# EAGLE design Cube_8x8x8_LED_Base (EAGLE 9.6.2)
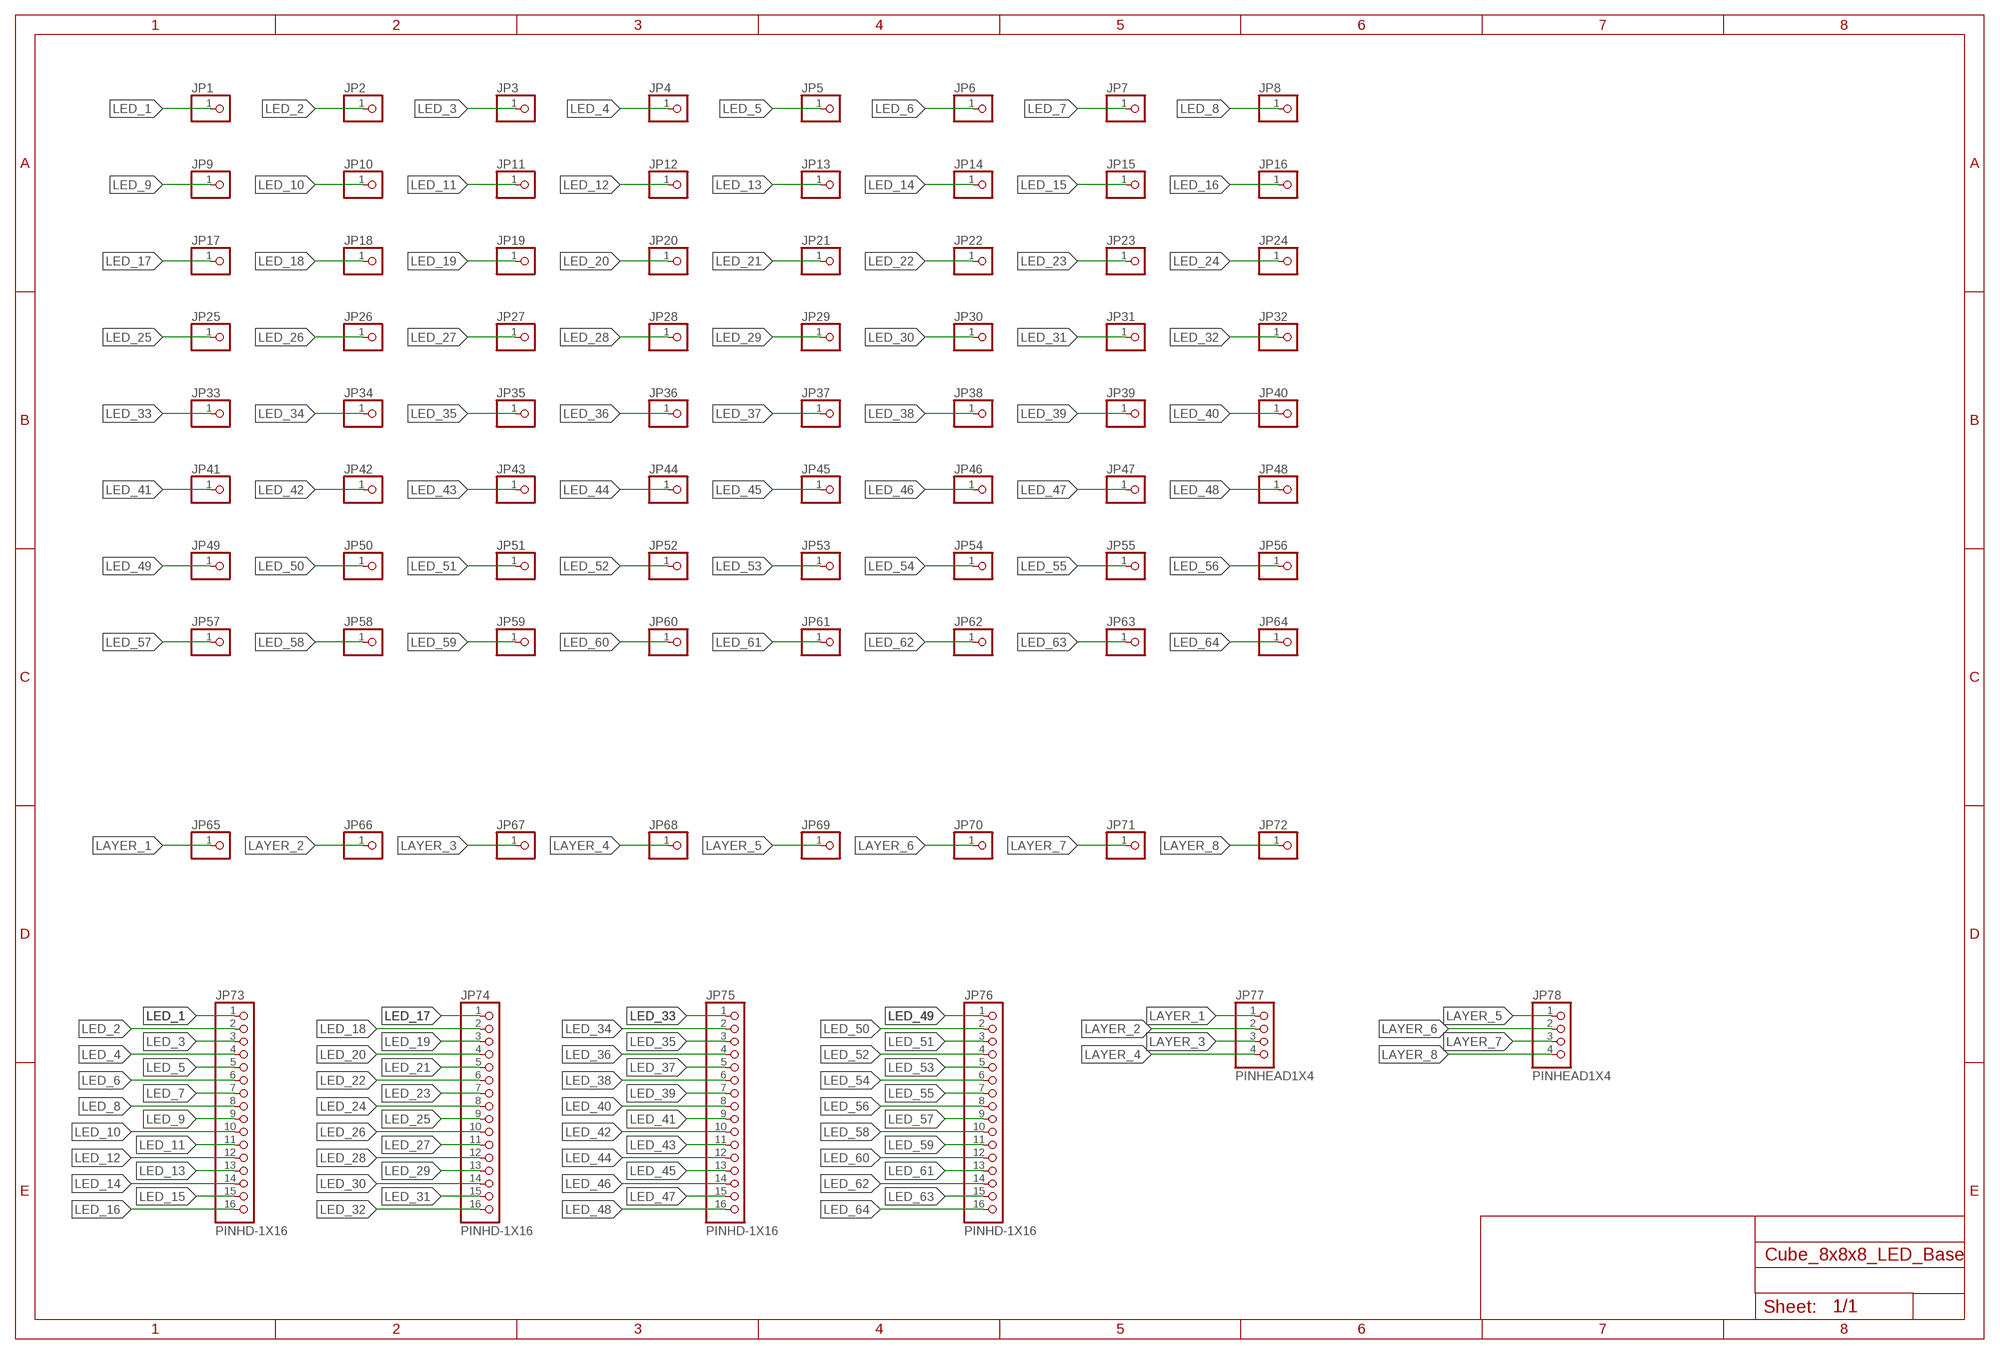
[diagram p0: schematic, sheet 1]

## Parts
JP1  PINHD-1X1  [1X01]
JP2  PINHD-1X1  [1X01]
JP3  PINHD-1X1  [1X01]
JP4  PINHD-1X1  [1X01]
JP5  PINHD-1X1  [1X01]
JP6  PINHD-1X1  [1X01]
JP7  PINHD-1X1  [1X01]
JP8  PINHD-1X1  [1X01]
JP9  PINHD-1X1  [1X01]
JP10  PINHD-1X1  [1X01]
JP11  PINHD-1X1  [1X01]
JP12  PINHD-1X1  [1X01]
JP13  PINHD-1X1  [1X01]
JP14  PINHD-1X1  [1X01]
JP15  PINHD-1X1  [1X01]
JP16  PINHD-1X1  [1X01]
JP17  PINHD-1X1  [1X01]
JP18  PINHD-1X1  [1X01]
JP19  PINHD-1X1  [1X01]
JP20  PINHD-1X1  [1X01]
JP21  PINHD-1X1  [1X01]
JP22  PINHD-1X1  [1X01]
JP23  PINHD-1X1  [1X01]
JP24  PINHD-1X1  [1X01]
JP25  PINHD-1X1  [1X01]
JP26  PINHD-1X1  [1X01]
JP27  PINHD-1X1  [1X01]
JP28  PINHD-1X1  [1X01]
JP29  PINHD-1X1  [1X01]
JP30  PINHD-1X1  [1X01]
JP31  PINHD-1X1  [1X01]
JP32  PINHD-1X1  [1X01]
JP33  PINHD-1X1  [1X01]
JP34  PINHD-1X1  [1X01]
JP35  PINHD-1X1  [1X01]
JP36  PINHD-1X1  [1X01]
JP37  PINHD-1X1  [1X01]
JP38  PINHD-1X1  [1X01]
JP39  PINHD-1X1  [1X01]
JP40  PINHD-1X1  [1X01]
JP41  PINHD-1X1  [1X01]
JP42  PINHD-1X1  [1X01]
JP43  PINHD-1X1  [1X01]
JP44  PINHD-1X1  [1X01]
JP45  PINHD-1X1  [1X01]
JP46  PINHD-1X1  [1X01]
JP47  PINHD-1X1  [1X01]
JP48  PINHD-1X1  [1X01]
JP49  PINHD-1X1  [1X01]
JP50  PINHD-1X1  [1X01]
JP51  PINHD-1X1  [1X01]
JP52  PINHD-1X1  [1X01]
JP53  PINHD-1X1  [1X01]
JP54  PINHD-1X1  [1X01]
JP55  PINHD-1X1  [1X01]
JP56  PINHD-1X1  [1X01]
JP57  PINHD-1X1  [1X01]
JP58  PINHD-1X1  [1X01]
JP59  PINHD-1X1  [1X01]
JP60  PINHD-1X1  [1X01]
JP61  PINHD-1X1  [1X01]
JP62  PINHD-1X1  [1X01]
JP63  PINHD-1X1  [1X01]
JP64  PINHD-1X1  [1X01]
JP65  PINHD-1X1  [1X01]
JP66  PINHD-1X1  [1X01]
JP67  PINHD-1X1  [1X01]
JP68  PINHD-1X1  [1X01]
JP69  PINHD-1X1  [1X01]
JP70  PINHD-1X1  [1X01]
JP71  PINHD-1X1  [1X01]
JP72  PINHD-1X1  [1X01]
JP73  PINHD-1X16  [2X16]
JP74  PINHD-1X16  [2X16]
JP75  PINHD-1X16  [2X16]
JP76  PINHD-1X16  [2X16]
JP77  PINHEAD1X4  [2X04]
JP78  PINHEAD1X4  [2X04]

## Nets
LAYER_1: JP65.1 JP77.1
LAYER_2: JP66.1 JP77.2
LAYER_3: JP67.1 JP77.3
LAYER_4: JP68.1 JP77.4
LAYER_5: JP69.1 JP78.1
LAYER_6: JP70.1 JP78.2
LAYER_7: JP71.1 JP78.3
LAYER_8: JP72.1 JP78.4
LED_1: JP1.1 JP73.1
LED_2: JP2.1 JP73.2
LED_3: JP3.1 JP73.3
LED_4: JP4.1 JP73.4
LED_5: JP5.1 JP73.5
LED_6: JP6.1 JP73.6
LED_7: JP7.1 JP73.7
LED_8: JP8.1 JP73.8
LED_9: JP9.1 JP73.9
LED_10: JP10.1 JP73.10
LED_11: JP11.1 JP73.11
LED_12: JP12.1 JP73.12
LED_13: JP13.1 JP73.13
LED_14: JP14.1 JP73.14
LED_15: JP15.1 JP73.15
LED_16: JP16.1 JP73.16
LED_17: JP17.1 JP74.1
LED_18: JP18.1 JP74.2
LED_19: JP19.1 JP74.3
LED_20: JP20.1 JP74.4
LED_21: JP21.1 JP74.5
LED_22: JP22.1 JP74.6
LED_23: JP23.1 JP74.7
LED_24: JP24.1 JP74.8
LED_25: JP25.1 JP74.9
LED_26: JP26.1 JP74.10
LED_27: JP27.1 JP74.11
LED_28: JP28.1 JP74.12
LED_29: JP29.1 JP74.13
LED_30: JP30.1 JP74.14
LED_31: JP31.1 JP74.15
LED_32: JP32.1 JP74.16
LED_33: JP33.1 JP75.1
LED_34: JP34.1 JP75.2
LED_35: JP35.1 JP75.3
LED_36: JP36.1 JP75.4
LED_37: JP37.1 JP75.5
LED_38: JP38.1 JP75.6
LED_39: JP39.1 JP75.7
LED_40: JP40.1 JP75.8
LED_41: JP41.1 JP75.9
LED_42: JP42.1 JP75.10
LED_43: JP43.1 JP75.11
LED_44: JP44.1 JP75.12
LED_45: JP45.1 JP75.13
LED_46: JP46.1 JP75.14
LED_47: JP47.1 JP75.15
LED_48: JP48.1 JP75.16
LED_49: JP49.1 JP76.1
LED_50: JP50.1 JP76.2
LED_51: JP51.1 JP76.3
LED_52: JP52.1 JP76.4
LED_53: JP53.1 JP76.5
LED_54: JP54.1 JP76.6
LED_55: JP55.1 JP76.7
LED_56: JP56.1 JP76.8
LED_57: JP57.1 JP76.9
LED_58: JP58.1 JP76.10
LED_59: JP59.1 JP76.11
LED_60: JP60.1 JP76.12
LED_61: JP61.1 JP76.13
LED_62: JP62.1 JP76.14
LED_63: JP63.1 JP76.15
LED_64: JP64.1 JP76.16

## Library data of the parts
JP1-JP72 = pinhead:PINHD-1X1: PIN HEADER
JP73-JP76 = pinhead1x16:PINHD-1X16
JP77 JP78 = pinhead1x4:PINHEAD1X4

## Board
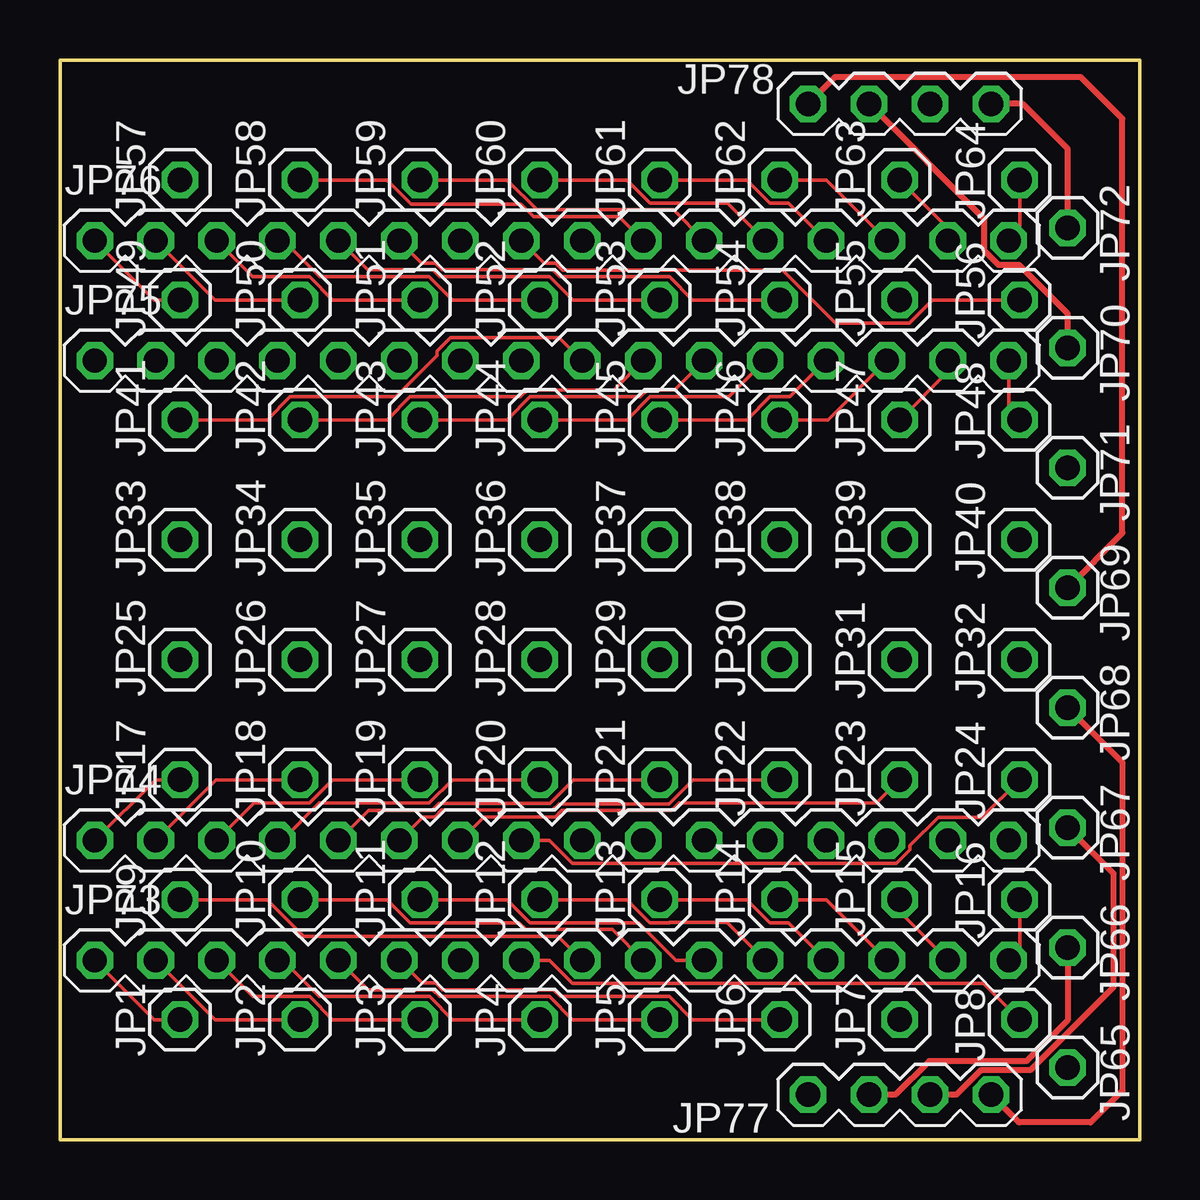
[diagram p1: board, top side]
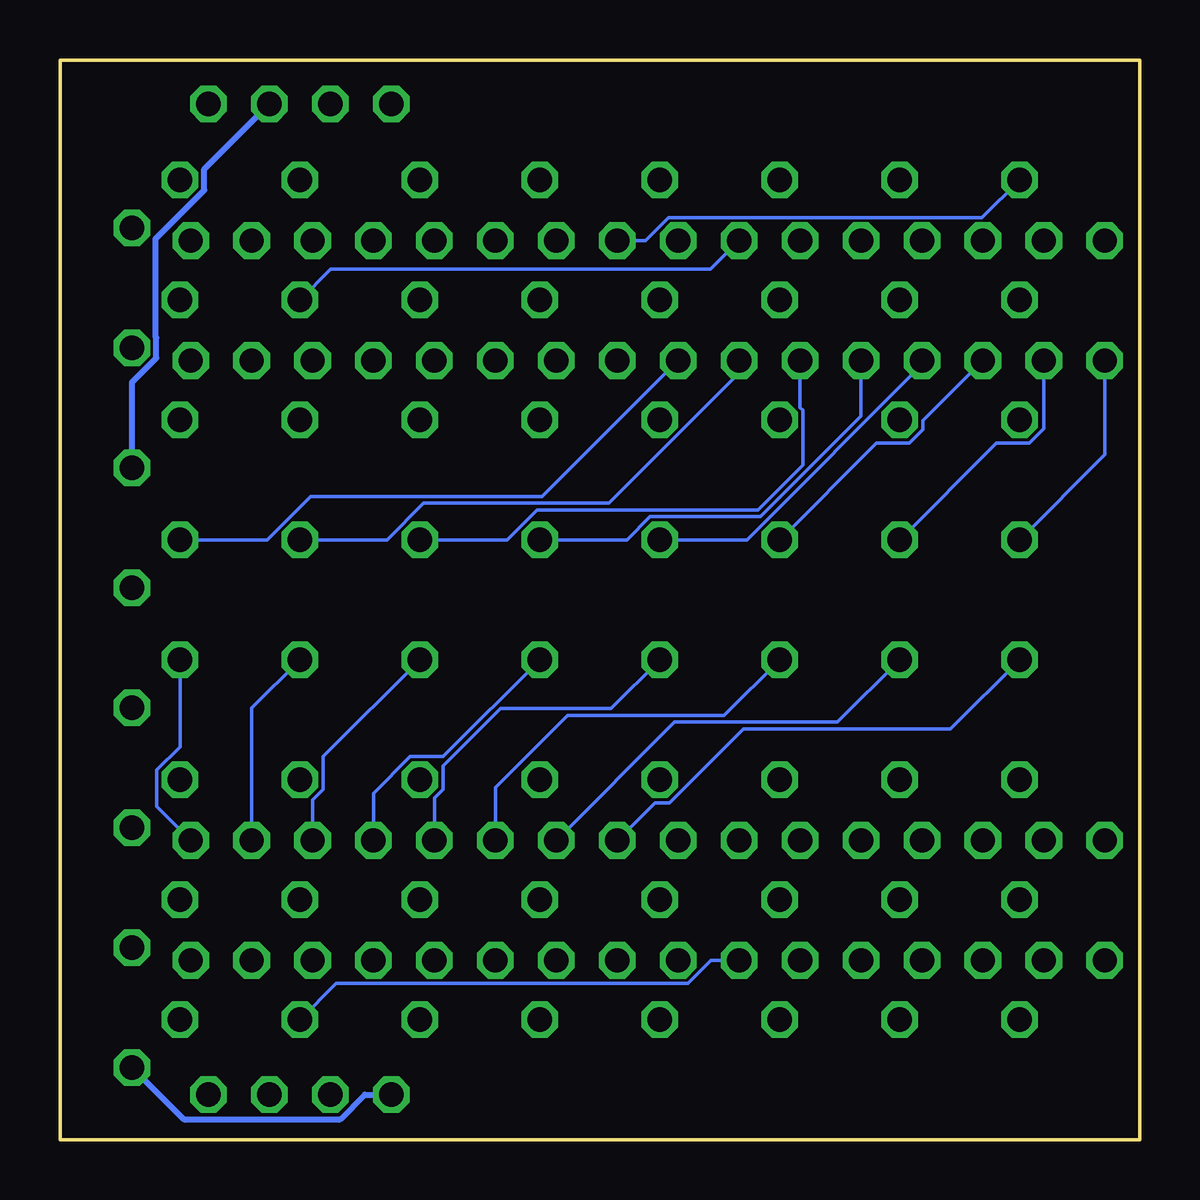
[diagram p2: board, bottom side, seen from below]

Size 45 x 45 mm. Coordinates in mm from the lower left corner, seen from the top.
Outline: 0,0 0,45 45,45 45,0 0,0
Copper layers (1*16): Top 0.035mm / dielectric 1.5mm / Bottom 0.035mm
Design rules "reglejlcpcb": minimum track width 5mil, minimum drill 0.35mm, track to track 5mil, track to pad 5mil, pad to pad 5mil, via to via 5mil, smd to smd 5mil, copper to edge 20mil, drill to drill 20mil, minimum pad ring 10mil, minimum via ring 8mil, stop-mask expansion 4mil, vias tented up to drill 0mil, thermal gap 10mil

### Footprints (pad centres in the part's own frame; a part is rotated, then mirrored left to right if it is on the bottom)
1X01 = drill 1.016 octagon: 1 0,0
2X16 = drill 1.016 octagon: 1 -19.05,1.27; 2 -16.51,1.27; 3 -13.97,1.27; 4 -11.43,1.27; 5 -8.89,1.27; 6 -6.35,1.27; 7 -3.81,1.27; 8 -1.27,1.27; 9 1.27,1.27; 10 3.81,1.27; 11 6.35,1.27; 12 8.89,1.27; 13 11.43,1.27; 14 13.97,1.27; 15 16.51,1.27; 16 19.05,1.27
2X04 = drill 1.016 octagon: 1 -3.81,1.27; 2 -1.27,1.27; 3 1.27,1.27; 4 3.81,1.27

### Placement (x,y rotation side)
JP1  5,5 0 top
JP2  10,5 0 top
JP3  15,5 0 top
JP4  20,5 0 top
JP5  25,5 0 top
JP6  30,5 0 top
JP7  35,5 0 top
JP8  40,5 0 top
JP9  5,10 0 top
JP10  10,10 0 top
JP11  15,10 0 top
JP12  20,10 0 top
JP13  25,10 0 top
JP14  30,10 0 top
JP15  35,10 0 top
JP16  40,10 0 top
JP17  5,15 0 top
JP18  10,15 0 top
JP19  15,15 0 top
JP20  20,15 0 top
JP21  25,15 0 top
JP22  30,15 0 top
JP23  35,15 0 top
JP24  40,15 0 top
JP25  5,20 0 top
JP26  10,20 0 top
JP27  15,20 0 top
JP28  20,20 0 top
JP29  25,20 0 top
JP30  30,20 0 top
JP31  35,20 0 top
JP32  40,20 0 top
JP33  5,25 0 top
JP34  10,25 0 top
JP35  15,25 0 top
JP36  20,25 0 top
JP37  25,25 0 top
JP38  30,25 0 top
JP39  35,25 0 top
JP40  40,25 0 top
JP41  5,30 0 top
JP42  10,30 0 top
JP43  15,30 0 top
JP44  20,30 0 top
JP45  25,30 0 top
JP46  30,30 0 top
JP47  35,30 0 top
JP48  40,30 0 top
JP49  5,35 0 top
JP50  10,35 0 top
JP51  15,35 0 top
JP52  20,35 0 top
JP53  25,35 0 top
JP54  30,35 0 top
JP55  35,35 0 top
JP56  40,35 0 top
JP57  5,40 0 top
JP58  10,40 0 top
JP59  15,40 0 top
JP60  20,40 0 top
JP61  25,40 0 top
JP62  30,40 0 top
JP63  35,40 0 top
JP64  40,40 0 top
JP65  42,3 180 top
JP66  42,8 180 top
JP67  42,13 180 top
JP68  42,18 180 top
JP69  42,23 180 top
JP70  42,33 180 top
JP71  42,28 180 top
JP72  42,38 180 top
JP73  20.5,6.2 0 top
JP74  20.5,11.2 0 top
JP75  20.5,31.2 0 top
JP76  20.5,36.2 0 top
JP77  35,0.6 0 top
JP78  35,41.9 0 top

### Tracks (layer width: path | path; a pad name or v marks a point on that pad's centre or on a via)
LAYER_1
  Bottom 0.254: JP77.1 32.29,1.87 33.31,0.85 39.85,0.85 JP65.1
LAYER_2
  Top 0.254: JP66.1 42,4.98 40.29,3.27 36.23,3.27 34.83,1.87 JP77.2
LAYER_3
  Top 0.254: JP67.1 43.91,11.09 43.91,6.34 40.45,2.89 38.39,2.89 37.37,1.87 JP77.3
LAYER_4
  Top 0.254: JP68.1 44.29,15.71 44.29,2.04 42.96,0.71 39.97,0.71 JP77.4
LAYER_5
  Top 0.254: JP69.1 44.29,25.29 44.29,42.55 42.55,44.29 32.31,44.29 JP78.1
LAYER_6
  Top 0.254: JP78.2 38.53,38.37 38.53,37.05 39.13,36.45 39.98,36.45 42,34.44 JP70.1
LAYER_7
  Bottom 0.254: JP71.1 42,31.56 40.98,32.58 40.98,33.42 41.02,33.45 41.02,37.55 38.98,39.58 38.98,40.46 JP78.3
LAYER_8
  Top 0.254: JP72.1 42,41.3 40.13,43.17 JP78.4
LED_1
  Top 0.152: JP1.1 3.92,5 JP73.1
LED_2
  Top 0.152: JP2.1 6.46,5 JP73.2
LED_3
  Top 0.152: JP3.1 11.37,5 10.4,5.96 8.04,5.96 JP73.3
LED_4
  Top 0.152: JP4.1 16.36,5 15.4,5.96 10.8,5.96 9.3,7.47 JP73.4
LED_5
  Top 0.152: JP5.1 21.36,5 20.4,5.96 15.81,5.96 15.54,6.25 12.84,6.25 JP73.5
LED_6
  Top 0.152: JP73.6 15.1,6.52 15.65,6.52 15.93,6.25 20.58,6.25 20.86,5.97 25.4,5.97 26.37,5 JP6.1
LED_7
  Bottom 0.152: JP7.1 33.49,6.5 18.83,6.5 17.86,7.47 JP73.7
LED_8
  Top 0.152: JP8.1 38.49,6.5 21.37,6.5 20.41,7.47 JP73.8
LED_9
  Top 0.152: JP73.9 20.76,8.48 10.16,8.48 8.63,10 JP9.1
LED_10
  Top 0.152: JP10.1 13.63,10 14.6,9.04 19.14,9.04 19.43,8.76 23.02,8.76 JP73.10
LED_11
  Top 0.152: JP11.1 18.64,10 19.6,9.04 24.11,9.04 25.68,7.47 JP73.11
LED_12
  Top 0.152: JP12.1 23.64,10 24.6,9.04 25.4,9.04 25.41,9.05 27.81,9.05 JP73.12
LED_13
  Top 0.152: JP73.13 30.36,9.04 29.6,9.04 28.64,10 JP13.1
LED_14
  Top 0.152: JP14.1 31.94,10 JP73.14
LED_15
  Top 0.152: JP15.1 35,9.48 JP73.15
LED_16
  Top 0.152: JP16.1 40,7.92 JP73.16
LED_17
  Top 0.152: JP17.1 3.98,15 JP74.1
LED_18
  Top 0.152: JP18.1 6.52,15 JP74.2
LED_19
  Top 0.152: JP19.1 11.37,15 10.4,14.04 8.1,14.04 JP74.3
LED_20
  Top 0.152: JP74.4 9.25,12.47 10.8,14.03 15.39,14.03 16.36,15 JP20.1
LED_21
  Top 0.152: JP74.5 12.87,13.73 15.51,13.73 15.8,14.02 20.42,14.02 21.4,15 JP21.1
LED_22
  Top 0.152: JP22.1 26.38,15 25.38,14 20.8,14 20.53,13.73 15.91,13.73 15.63,13.45 15.13,13.45 JP74.6
LED_23
  Top 0.152: JP23.1 34.03,14.04 25.81,14.04 25.5,13.72 20.92,13.72 20.65,13.45 17.67,13.45 JP74.7
LED_24
  Top 0.152: JP24.1 38.44,13.44 36.61,13.44 35.44,12.26 35.44,12.07 34.87,11.51 21.37,11.51 20.41,12.47 JP74.8
LED_25
  Bottom 0.152: JP25.1 7.88,17.12 16.51,17.12 19.6,14.04 20.2,14.04 JP74.9
LED_26
  Bottom 0.152: JP26.1 12.6,17.4 19.38,17.4 JP74.10
LED_27
  Bottom 0.152: JP27.1 17.32,17.68 23.84,17.68 26.85,14.67 JP74.11
LED_28
  Bottom 0.152: JP28.1 22.04,17.96 26.64,17.96 29.04,15.57 29.04,14.6 29.39,14.24 JP74.12
LED_29
  Bottom 0.152: JP29.1 29.04,15.96 30.4,15.96 31.93,14.44 JP74.13
LED_30
  Bottom 0.152: JP74.14 34.47,14.16 34.03,14.6 34.03,15.96 JP30.1
LED_31
  Bottom 0.152: JP31.1 37.01,17.99 JP74.15
LED_32
  Bottom 0.152: JP32.1 40,16.36 40.97,15.4 40.97,13.88 JP74.16
LED_33
  Bottom 0.152: JP33.1 1.45,28.55 JP75.1
LED_34
  Bottom 0.152: JP34.1 5.96,29.04 4.6,29.04 3.99,29.64 JP75.2
LED_35
  Bottom 0.152: JP35.1 10.96,29.04 9.6,29.04 9.04,29.6 9.04,29.96 JP75.3
LED_36
  Bottom 0.152: JP36.1 16.36,25 9.07,32.3 JP75.4
LED_37
  Bottom 0.152: JP37.1 21.36,25 20.4,25.96 15.79,25.96 11.61,30.15 JP75.5
LED_38
  Bottom 0.152: JP38.1 26.36,25 25.12,26.25 15.91,26.25 14.04,28.12 14.04,30.4 14.15,30.52 JP75.6
LED_39
  Bottom 0.152: JP39.1 31.36,25 29.84,26.52 22.11,26.52 16.69,31.95 JP75.7
LED_40
  Bottom 0.152: JP40.1 36.37,25 34.56,26.8 24.9,26.8 JP75.8
LED_41
  Top 0.152: JP41.1 8.63,30 9.6,30.96 14.01,30.96 15.72,32.68 15.72,32.87 16.29,33.44 20.8,33.44 JP75.9
LED_42
  Top 0.152: JP42.1 13.63,30 14.6,30.96 19.2,30.96 19.48,31.25 23.09,31.25 JP75.10
LED_43
  Top 0.152: JP43.1 18.64,30 19.6,30.96 24.2,30.96 24.48,31.25 25.62,31.25 JP75.11
LED_44
  Top 0.152: JP44.1 23.64,30 24.6,30.96 27.89,30.96 JP75.12
LED_45
  Top 0.152: JP45.1 28.64,30 29.6,30.96 30.43,30.96 JP75.13
LED_46
  Top 0.152: JP46.1 32,30 JP75.14
LED_47
  Top 0.152: JP47.1 37.01,32.01 JP75.15
LED_48
  Top 0.152: JP48.1 39.55,30.45 JP75.16
LED_49
  Top 0.152: JP49.1 3.92,35 JP76.1
LED_50
  Top 0.152: JP50.1 6.46,35 JP76.2
LED_51
  Top 0.152: JP51.1 11.37,35 10.4,35.97 8.04,35.97 JP76.3
LED_52
  Top 0.152: JP76.4 9.32,37.47 10.81,35.98 15.39,35.98 16.36,35 JP52.1
LED_53
  Top 0.152: JP76.5 12.82,36.26 15.53,36.26 15.82,35.97 20.4,35.97 21.38,35 JP53.1
LED_54
  Top 0.152: JP76.6 15.08,36.54 15.65,36.54 15.93,36.25 20.54,36.25 20.83,35.97 25.4,35.97 26.36,35 JP54.1
LED_55
  Bottom 0.152: JP55.1 33.72,36.28 17.88,36.28 JP76.7
LED_56
  Top 0.152: JP76.8 20.17,36.53 20.66,36.53 20.94,36.25 30.12,36.25 32.33,34.03 35.4,34.03 36.37,35 JP56.1
LED_57
  Bottom 0.152: JP57.1 6.57,38.44 19.63,38.44 20.59,37.47 JP76.9
LED_58
  Top 0.152: JP76.10 23.31,38.47 19.74,38.47 19.21,39 14.64,39 13.63,40 JP58.1
LED_59
  Top 0.152: JP76.11 25.57,38.76 19.88,38.76 18.64,40 JP59.1
LED_60
  Top 0.152: JP60.1 23.64,40 24.6,39.03 27.82,39.03 JP76.12
LED_61
  Top 0.152: JP76.13 30.36,39.03 29.6,39.03 28.64,40 JP61.1
LED_62
  Top 0.152: JP62.1 31.94,40 JP76.14
LED_63
  Top 0.152: JP63.1 37.01,37.99 JP76.15
LED_64
  Top 0.152: JP64.1 40,37.92 JP76.16